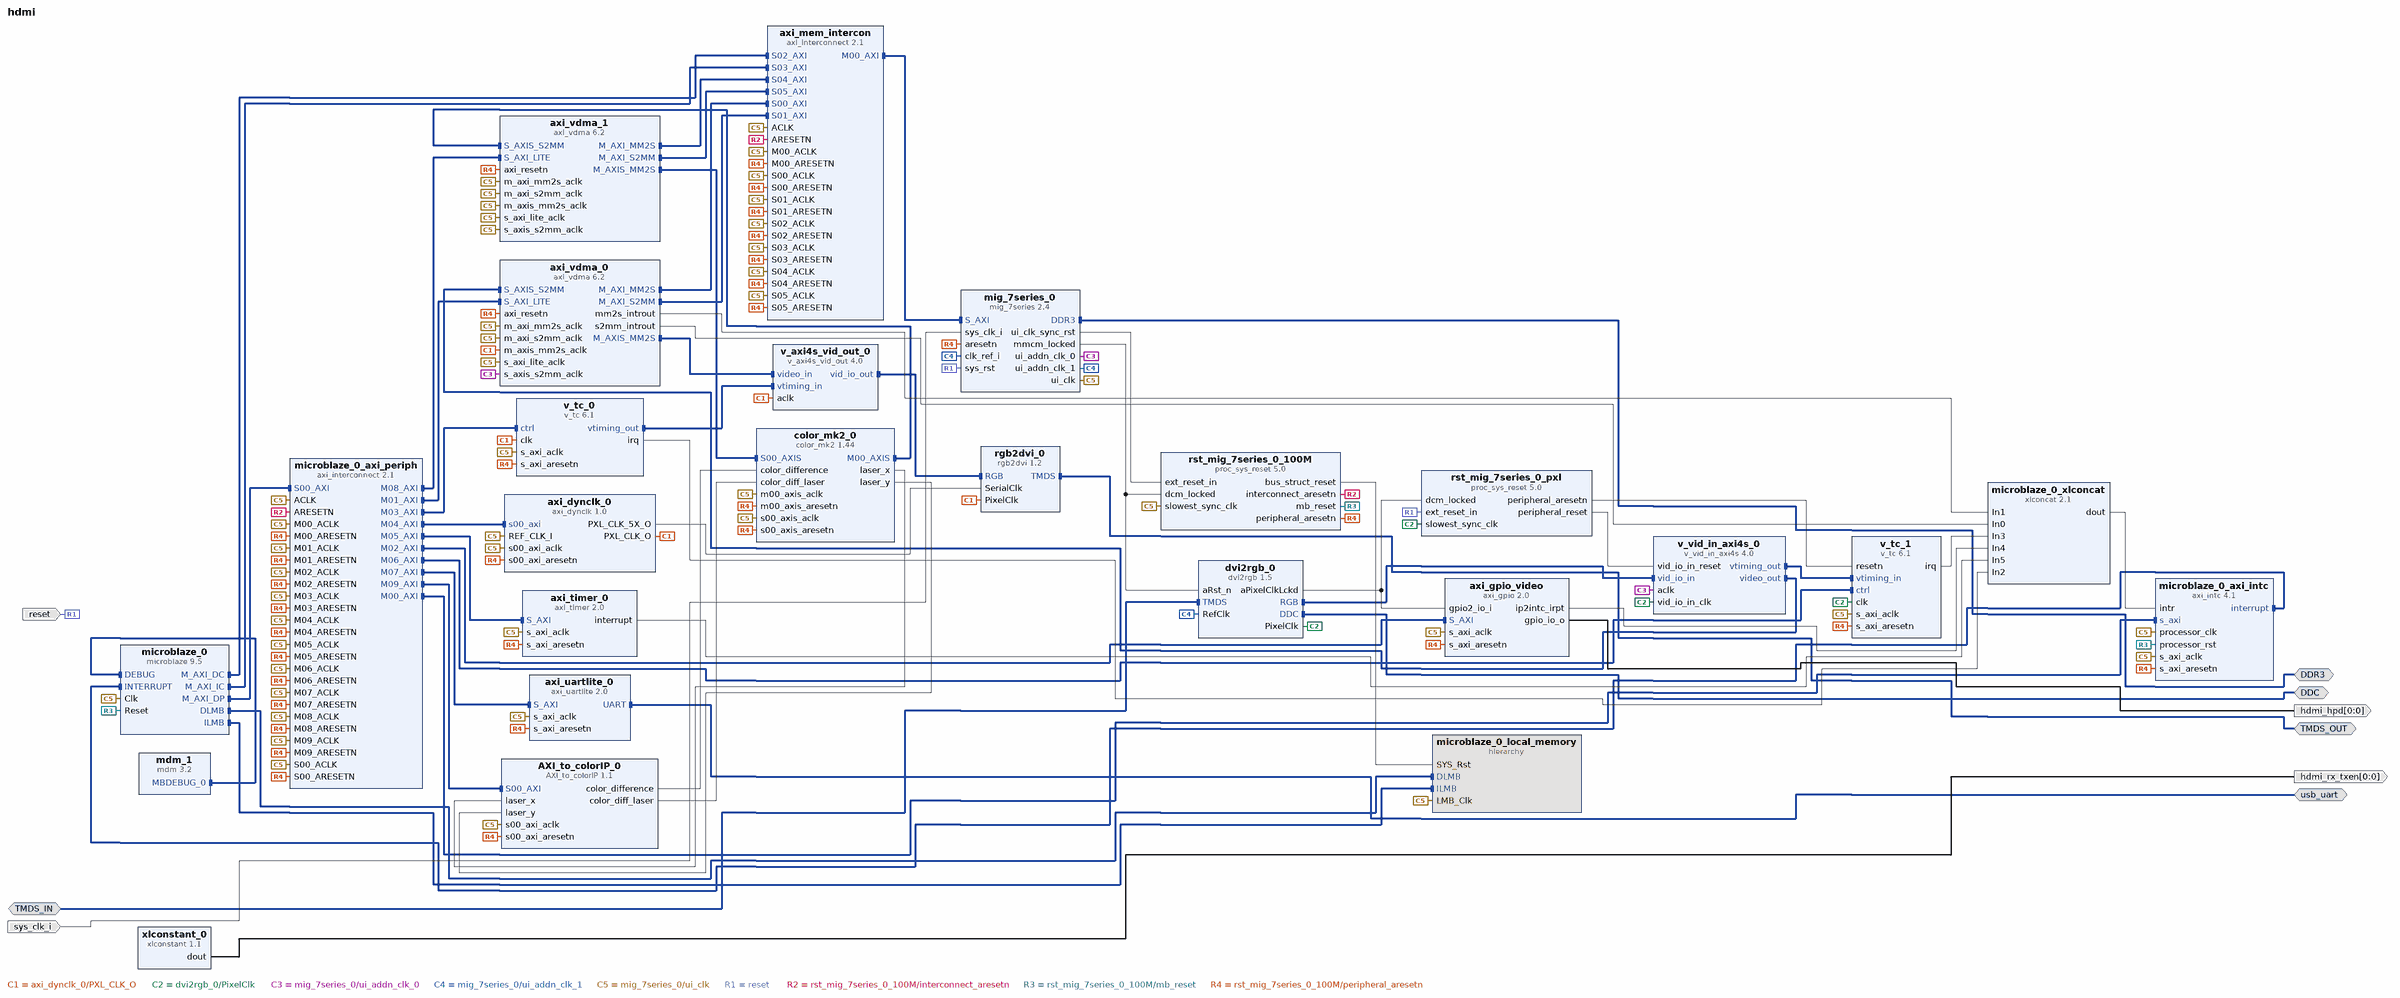
[diagram p0: block diagram of the top level]
# Vivado block design hdmi, Vivado 2015.3
create_bd_design hdmi

create_bd_intf_port -mode Master -vlnv xilinx.com:interface:iic_rtl:1.0 DDC
create_bd_intf_port -mode Master -vlnv xilinx.com:interface:ddrx_rtl:1.0 DDR3
create_bd_intf_port -mode Slave -vlnv digilentinc.com:interface:tmds_rtl:1.0 TMDS_IN
create_bd_intf_port -mode Master -vlnv digilentinc.com:interface:tmds_rtl:1.0 TMDS_OUT
create_bd_intf_port -mode Master -vlnv xilinx.com:interface:uart_rtl:1.0 usb_uart
create_bd_port -dir O -from 0 -to 0 hdmi_hpd
create_bd_port -dir I -type rst reset
set_property -dict {CONFIG.POLARITY ACTIVE_LOW} [get_bd_ports reset]
create_bd_port -dir I -type clk sys_clk_i
set_property -dict {CONFIG.FREQ_HZ 200000000 CONFIG.PHASE 0.0 CONFIG.CLK_DOMAIN /clk_wiz_0_clk_out1} [get_bd_ports sys_clk_i]
create_bd_port -dir O -from 0 -to 0 hdmi_rx_txen

create_bd_cell -type ip -vlnv digilentinc.com:ip:axi_dynclk:1.0 axi_dynclk_0
create_bd_cell -type ip -vlnv xilinx.com:ip:axi_gpio:2.0 axi_gpio_video
set_property -dict [list \
  CONFIG.C_GPIO_WIDTH 1 \
  CONFIG.C_GPIO2_WIDTH 1 \
  CONFIG.C_IS_DUAL 1 \
  CONFIG.C_ALL_INPUTS_2 1 \
  CONFIG.C_INTERRUPT_PRESENT 1 \
  CONFIG.USE_BOARD_FLOW true \
  CONFIG.GPIO_BOARD_INTERFACE Custom \
  CONFIG.C_ALL_OUTPUTS 1 \
] [get_bd_cells axi_gpio_video]
create_bd_cell -type ip -vlnv xilinx.com:ip:axi_interconnect:2.1 axi_mem_intercon
set_property -dict [list \
  CONFIG.NUM_SI 6 \
  CONFIG.NUM_MI 1 \
  CONFIG.STRATEGY 2 \
  CONFIG.M00_HAS_REGSLICE 4 \
  CONFIG.M00_HAS_DATA_FIFO 0 \
  CONFIG.S00_HAS_REGSLICE 4 \
  CONFIG.S01_HAS_REGSLICE 4 \
  CONFIG.S02_HAS_REGSLICE 4 \
  CONFIG.S03_HAS_REGSLICE 4 \
  CONFIG.S00_HAS_DATA_FIFO 2 \
  CONFIG.S01_HAS_DATA_FIFO 2 \
  CONFIG.S02_HAS_DATA_FIFO 2 \
  CONFIG.S03_HAS_DATA_FIFO 2 \
  CONFIG.S04_HAS_DATA_FIFO 2 \
  CONFIG.S05_HAS_DATA_FIFO 2 \
] [get_bd_cells axi_mem_intercon]
create_bd_cell -type ip -vlnv xilinx.com:ip:axi_timer:2.0 axi_timer_0
create_bd_cell -type ip -vlnv xilinx.com:ip:axi_uartlite:2.0 axi_uartlite_0
set_property -dict [list \
  CONFIG.C_BAUDRATE 115200 \
  CONFIG.USE_BOARD_FLOW true \
  CONFIG.UARTLITE_BOARD_INTERFACE usb_uart \
] [get_bd_cells axi_uartlite_0]
create_bd_cell -type ip -vlnv xilinx.com:ip:axi_vdma:6.2 axi_vdma_0
set_property -dict [list \
  CONFIG.c_m_axi_mm2s_data_width 128 \
  CONFIG.c_m_axis_mm2s_tdata_width 24 \
  CONFIG.c_m_axi_s2mm_data_width 128 \
  CONFIG.c_include_s2mm_dre 0 \
  CONFIG.c_mm2s_genlock_mode 0 \
  CONFIG.c_s2mm_genlock_mode 0 \
  CONFIG.c_mm2s_linebuffer_depth 4096 \
  CONFIG.c_s2mm_linebuffer_depth 4096 \
  CONFIG.c_mm2s_max_burst_length 32 \
  CONFIG.c_s2mm_max_burst_length 32 \
  CONFIG.c_include_s2mm 1 \
  CONFIG.c_addr_width 32 \
] [get_bd_cells axi_vdma_0]
create_bd_cell -type ip -vlnv digilentinc.com:ip:dvi2rgb:1.5 dvi2rgb_0
set_property -dict {CONFIG.kRstActiveHigh false CONFIG.kClkRange 2 CONFIG.kAddBUFG false} [get_bd_cells dvi2rgb_0]
create_bd_cell -type ip -vlnv xilinx.com:ip:mdm:3.2 mdm_1
create_bd_cell -type ip -vlnv xilinx.com:ip:microblaze:9.5 microblaze_0
set_property -dict [list \
  CONFIG.C_D_AXI 1 \
  CONFIG.C_D_LMB 1 \
  CONFIG.C_I_LMB 1 \
  CONFIG.C_ENABLE_DISCRETE_PORTS 0 \
  CONFIG.G_TEMPLATE_LIST 2 \
  CONFIG.G_USE_EXCEPTIONS 1 \
  CONFIG.C_USE_MSR_INSTR 1 \
  CONFIG.C_USE_PCMP_INSTR 1 \
  CONFIG.C_USE_REORDER_INSTR 1 \
  CONFIG.C_USE_BARREL 1 \
  CONFIG.C_USE_DIV 1 \
  CONFIG.C_USE_HW_MUL 2 \
  CONFIG.C_USE_FPU 2 \
  CONFIG.C_DEBUG_ENABLED 2 \
  CONFIG.C_DEBUG_COUNTER_WIDTH 32 \
  CONFIG.C_USE_ICACHE 1 \
  CONFIG.C_CACHE_BYTE_SIZE 32768 \
  CONFIG.C_ICACHE_LINE_LEN 8 \
  CONFIG.C_ICACHE_VICTIMS 8 \
  CONFIG.C_ICACHE_STREAMS 1 \
  CONFIG.C_ICACHE_DATA_WIDTH 1 \
  CONFIG.C_USE_DCACHE 1 \
  CONFIG.C_DCACHE_BYTE_SIZE 32768 \
  CONFIG.C_DCACHE_LINE_LEN 8 \
  CONFIG.C_DCACHE_USE_WRITEBACK 1 \
  CONFIG.C_DCACHE_VICTIMS 8 \
  CONFIG.C_DCACHE_DATA_WIDTH 1 \
  CONFIG.C_USE_BRANCH_TARGET_CACHE 0 \
] [get_bd_cells microblaze_0]
create_bd_cell -type ip -vlnv xilinx.com:ip:axi_intc:4.1 microblaze_0_axi_intc
set_property -dict {CONFIG.C_HAS_FAST 1} [get_bd_cells microblaze_0_axi_intc]
create_bd_cell -type ip -vlnv xilinx.com:ip:axi_interconnect:2.1 microblaze_0_axi_periph
set_property -dict {CONFIG.NUM_MI 10} [get_bd_cells microblaze_0_axi_periph]
create_bd_cell -type hier microblaze_0_local_memory
create_bd_cell -type ip -vlnv xilinx.com:ip:xlconcat:2.1 microblaze_0_xlconcat
set_property -dict {CONFIG.NUM_PORTS 6} [get_bd_cells microblaze_0_xlconcat]
create_bd_cell -type ip -vlnv xilinx.com:ip:mig_7series:2.4 mig_7series_0
set_property -dict [list \
  CONFIG.XML_INPUT_FILE mig_b.prj \
  CONFIG.RESET_BOARD_INTERFACE reset \
  CONFIG.BOARD_MIG_PARAM Custom \
] [get_bd_cells mig_7series_0]
create_bd_cell -type ip -vlnv digilentinc.com:ip:rgb2dvi:1.2 rgb2dvi_0
set_property -dict {CONFIG.kRstActiveHigh false CONFIG.kGenerateSerialClk false CONFIG.kClkRange 2} [get_bd_cells rgb2dvi_0]
create_bd_cell -type ip -vlnv xilinx.com:ip:proc_sys_reset:5.0 rst_mig_7series_0_100M
create_bd_cell -type ip -vlnv xilinx.com:ip:proc_sys_reset:5.0 rst_mig_7series_0_pxl
set_property -dict {CONFIG.USE_BOARD_FLOW true CONFIG.RESET_BOARD_INTERFACE Custom} [get_bd_cells rst_mig_7series_0_pxl]
create_bd_cell -type ip -vlnv xilinx.com:ip:v_axi4s_vid_out:4.0 v_axi4s_vid_out_0
set_property -dict [list \
  CONFIG.C_S_AXIS_VIDEO_FORMAT 2 \
  CONFIG.C_S_AXIS_VIDEO_DATA_WIDTH 8 \
  CONFIG.C_ADDR_WIDTH 5 \
  CONFIG.C_VTG_MASTER_SLAVE 1 \
] [get_bd_cells v_axi4s_vid_out_0]
create_bd_cell -type ip -vlnv xilinx.com:ip:v_tc:6.1 v_tc_0
set_property -dict {CONFIG.enable_detection false} [get_bd_cells v_tc_0]
create_bd_cell -type ip -vlnv xilinx.com:ip:v_tc:6.1 v_tc_1
set_property -dict [list \
  CONFIG.HAS_INTC_IF true \
  CONFIG.max_lines_per_frame 2048 \
  CONFIG.horizontal_blank_detection false \
  CONFIG.enable_generation false \
  CONFIG.vertical_blank_detection false \
] [get_bd_cells v_tc_1]
create_bd_cell -type ip -vlnv xilinx.com:ip:v_vid_in_axi4s:4.0 v_vid_in_axi4s_0
set_property -dict {CONFIG.C_HAS_ASYNC_CLK 1 CONFIG.C_ADDR_WIDTH 5} [get_bd_cells v_vid_in_axi4s_0]
create_bd_cell -type ip -vlnv xilinx.com:ip:xlconstant:1.1 xlconstant_0
create_bd_cell -type ip -vlnv xilinx.com:ip:axi_vdma:6.2 axi_vdma_1
set_property -dict [list \
  CONFIG.c_m_axi_mm2s_data_width 128 \
  CONFIG.c_m_axis_mm2s_tdata_width 24 \
  CONFIG.c_m_axi_s2mm_data_width 128 \
  CONFIG.c_include_s2mm_dre 0 \
  CONFIG.c_num_fstores 32 \
  CONFIG.c_use_s2mm_fsync 0 \
  CONFIG.c_mm2s_genlock_mode 0 \
  CONFIG.c_s2mm_genlock_mode 0 \
  CONFIG.c_mm2s_linebuffer_depth 16384 \
  CONFIG.c_s2mm_linebuffer_depth 16384 \
  CONFIG.c_mm2s_max_burst_length 32 \
  CONFIG.c_s2mm_max_burst_length 32 \
  CONFIG.c_include_s2mm 1 \
  CONFIG.c_addr_width 32 \
] [get_bd_cells axi_vdma_1]
create_bd_cell -type ip -vlnv xilinx.com:user:AXI_to_colorIP:1.1 AXI_to_colorIP_0
create_bd_cell -type ip -vlnv xilinx.com:user:color_mk2:1.44 color_mk2_0
set_property -dict {CONFIG.V_RESOLUTION 720 CONFIG.H_RESOLUTION 1920 CONFIG.NUM_LINES 4} [get_bd_cells color_mk2_0]

# ---- hierarchy /microblaze_0_local_memory ----
current_bd_instance /microblaze_0_local_memory
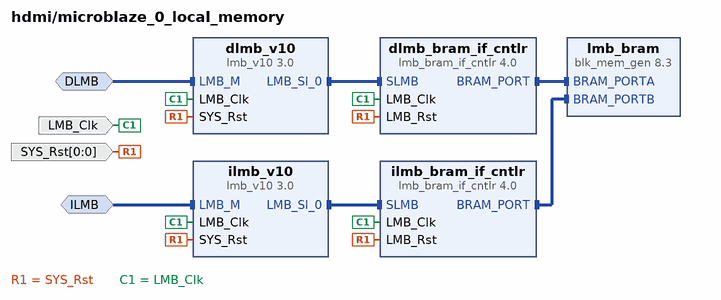
[diagram p1: block diagram inside /microblaze_0_local_memory]
create_bd_intf_pin -mode MirroredMaster -vlnv xilinx.com:interface:lmb_rtl:1.0 DLMB
create_bd_intf_pin -mode MirroredMaster -vlnv xilinx.com:interface:lmb_rtl:1.0 ILMB
create_bd_pin -dir I -type clk LMB_Clk
create_bd_pin -dir I -from 0 -to 0 -type rst SYS_Rst

create_bd_cell -type ip -vlnv xilinx.com:ip:lmb_bram_if_cntlr:4.0 dlmb_bram_if_cntlr
set_property -dict {CONFIG.C_ECC 0} [get_bd_cells dlmb_bram_if_cntlr]
create_bd_cell -type ip -vlnv xilinx.com:ip:lmb_v10:3.0 dlmb_v10
create_bd_cell -type ip -vlnv xilinx.com:ip:lmb_bram_if_cntlr:4.0 ilmb_bram_if_cntlr
set_property -dict {CONFIG.C_ECC 0} [get_bd_cells ilmb_bram_if_cntlr]
create_bd_cell -type ip -vlnv xilinx.com:ip:lmb_v10:3.0 ilmb_v10
create_bd_cell -type ip -vlnv xilinx.com:ip:blk_mem_gen:8.3 lmb_bram
set_property -dict {CONFIG.Memory_Type True_Dual_Port_RAM CONFIG.use_bram_block BRAM_Controller} [get_bd_cells lmb_bram]

# ---- connections ----

current_bd_instance /microblaze_0_local_memory
connect_bd_intf_net -intf_net microblaze_0_dlmb_bus [get_bd_intf_pins dlmb_bram_if_cntlr/SLMB] [get_bd_intf_pins dlmb_v10/LMB_Sl_0]
connect_bd_intf_net -intf_net microblaze_0_dlmb_cntlr [get_bd_intf_pins dlmb_bram_if_cntlr/BRAM_PORT] [get_bd_intf_pins lmb_bram/BRAM_PORTA]
connect_bd_intf_net -intf_net microblaze_0_ilmb_bus [get_bd_intf_pins ilmb_bram_if_cntlr/SLMB] [get_bd_intf_pins ilmb_v10/LMB_Sl_0]
connect_bd_intf_net -intf_net microblaze_0_ilmb_cntlr [get_bd_intf_pins ilmb_bram_if_cntlr/BRAM_PORT] [get_bd_intf_pins lmb_bram/BRAM_PORTB]
connect_bd_intf_net -intf_net microblaze_0_dlmb [get_bd_intf_pins DLMB] [get_bd_intf_pins dlmb_v10/LMB_M]
connect_bd_intf_net -intf_net microblaze_0_ilmb [get_bd_intf_pins ILMB] [get_bd_intf_pins ilmb_v10/LMB_M]
connect_bd_net [get_bd_pins SYS_Rst] \
  [get_bd_pins dlmb_bram_if_cntlr/LMB_Rst] [get_bd_pins dlmb_v10/SYS_Rst] [get_bd_pins ilmb_bram_if_cntlr/LMB_Rst] \
  [get_bd_pins ilmb_v10/SYS_Rst]
connect_bd_net -net microblaze_0_Clk [get_bd_pins LMB_Clk] \
  [get_bd_pins dlmb_bram_if_cntlr/LMB_Clk] [get_bd_pins dlmb_v10/LMB_Clk] [get_bd_pins ilmb_bram_if_cntlr/LMB_Clk] \
  [get_bd_pins ilmb_v10/LMB_Clk]

current_bd_instance /
connect_bd_intf_net [get_bd_intf_pins axi_mem_intercon/M00_AXI] [get_bd_intf_pins mig_7series_0/S_AXI]
connect_bd_intf_net [get_bd_intf_pins axi_vdma_0/M_AXIS_MM2S] [get_bd_intf_pins v_axi4s_vid_out_0/video_in]
connect_bd_intf_net [get_bd_intf_pins axi_mem_intercon/S00_AXI] [get_bd_intf_pins axi_vdma_0/M_AXI_MM2S]
connect_bd_intf_net [get_bd_intf_pins axi_mem_intercon/S01_AXI] [get_bd_intf_pins axi_vdma_0/M_AXI_S2MM]
connect_bd_intf_net [get_bd_intf_pins dvi2rgb_0/RGB] [get_bd_intf_pins v_vid_in_axi4s_0/vid_io_in]
connect_bd_intf_net [get_bd_intf_pins axi_mem_intercon/S02_AXI] [get_bd_intf_pins microblaze_0/M_AXI_DC]
connect_bd_intf_net [get_bd_intf_pins axi_mem_intercon/S03_AXI] [get_bd_intf_pins microblaze_0/M_AXI_IC]
connect_bd_intf_net -intf_net microblaze_0_axi_dp [get_bd_intf_pins microblaze_0/M_AXI_DP] [get_bd_intf_pins microblaze_0_axi_periph/S00_AXI]
connect_bd_intf_net [get_bd_intf_pins axi_vdma_0/S_AXI_LITE] [get_bd_intf_pins microblaze_0_axi_periph/M01_AXI]
connect_bd_intf_net [get_bd_intf_pins axi_gpio_video/S_AXI] [get_bd_intf_pins microblaze_0_axi_periph/M02_AXI]
connect_bd_intf_net [get_bd_intf_pins microblaze_0_axi_periph/M03_AXI] [get_bd_intf_pins v_tc_0/ctrl]
connect_bd_intf_net [get_bd_intf_pins axi_dynclk_0/s00_axi] [get_bd_intf_pins microblaze_0_axi_periph/M04_AXI]
connect_bd_intf_net [get_bd_intf_pins axi_timer_0/S_AXI] [get_bd_intf_pins microblaze_0_axi_periph/M05_AXI]
connect_bd_intf_net [get_bd_intf_pins microblaze_0_axi_periph/M06_AXI] [get_bd_intf_pins v_tc_1/ctrl]
connect_bd_intf_net [get_bd_intf_pins axi_uartlite_0/S_AXI] [get_bd_intf_pins microblaze_0_axi_periph/M07_AXI]
connect_bd_intf_net [get_bd_intf_pins mdm_1/MBDEBUG_0] [get_bd_intf_pins microblaze_0/DEBUG]
connect_bd_intf_net [get_bd_intf_pins microblaze_0/DLMB] [get_bd_intf_pins microblaze_0_local_memory/DLMB]
connect_bd_intf_net [get_bd_intf_pins microblaze_0/ILMB] [get_bd_intf_pins microblaze_0_local_memory/ILMB]
connect_bd_intf_net -intf_net microblaze_0_intc_axi [get_bd_intf_pins microblaze_0_axi_intc/s_axi] [get_bd_intf_pins microblaze_0_axi_periph/M00_AXI]
connect_bd_intf_net [get_bd_intf_pins microblaze_0/INTERRUPT] [get_bd_intf_pins microblaze_0_axi_intc/interrupt]
connect_bd_intf_net [get_bd_intf_pins rgb2dvi_0/RGB] [get_bd_intf_pins v_axi4s_vid_out_0/vid_io_out]
connect_bd_intf_net [get_bd_intf_pins v_axi4s_vid_out_0/vtiming_in] [get_bd_intf_pins v_tc_0/vtiming_out]
connect_bd_intf_net [get_bd_intf_pins axi_vdma_0/S_AXIS_S2MM] [get_bd_intf_pins v_vid_in_axi4s_0/video_out]
connect_bd_intf_net [get_bd_intf_pins v_tc_1/vtiming_in] [get_bd_intf_pins v_vid_in_axi4s_0/vtiming_out]
connect_bd_intf_net [get_bd_intf_pins microblaze_0_axi_periph/M08_AXI] [get_bd_intf_pins axi_vdma_1/S_AXI_LITE]
connect_bd_intf_net [get_bd_intf_pins axi_vdma_1/M_AXI_MM2S] [get_bd_intf_pins axi_mem_intercon/S04_AXI]
connect_bd_intf_net [get_bd_intf_pins axi_vdma_1/M_AXI_S2MM] [get_bd_intf_pins axi_mem_intercon/S05_AXI]
connect_bd_intf_net [get_bd_intf_pins microblaze_0_axi_periph/M09_AXI] [get_bd_intf_pins AXI_to_colorIP_0/S00_AXI]
connect_bd_intf_net [get_bd_intf_pins color_mk2_0/S00_AXIS] [get_bd_intf_pins axi_vdma_1/M_AXIS_MM2S]
connect_bd_intf_net [get_bd_intf_pins color_mk2_0/M00_AXIS] [get_bd_intf_pins axi_vdma_1/S_AXIS_S2MM]
connect_bd_intf_net [get_bd_intf_ports DDC] [get_bd_intf_pins dvi2rgb_0/DDC]
connect_bd_intf_net [get_bd_intf_ports DDR3] [get_bd_intf_pins mig_7series_0/DDR3]
connect_bd_intf_net [get_bd_intf_ports TMDS_IN] [get_bd_intf_pins dvi2rgb_0/TMDS]
connect_bd_intf_net [get_bd_intf_ports TMDS_OUT] [get_bd_intf_pins rgb2dvi_0/TMDS]
connect_bd_intf_net [get_bd_intf_ports usb_uart] [get_bd_intf_pins axi_uartlite_0/UART]
connect_bd_net -net SYS_Rst_1 [get_bd_pins rst_mig_7series_0_100M/bus_struct_reset] [get_bd_pins microblaze_0_local_memory/SYS_Rst]
connect_bd_net [get_bd_pins axi_dynclk_0/PXL_CLK_5X_O] [get_bd_pins rgb2dvi_0/SerialClk]
connect_bd_net [get_bd_pins axi_dynclk_0/PXL_CLK_O] \
  [get_bd_pins axi_vdma_0/m_axis_mm2s_aclk] [get_bd_pins rgb2dvi_0/PixelClk] [get_bd_pins v_axi4s_vid_out_0/aclk] \
  [get_bd_pins v_tc_0/clk]
connect_bd_net [get_bd_pins axi_gpio_video/gpio_io_o] [get_bd_ports hdmi_hpd]
connect_bd_net [get_bd_pins axi_gpio_video/ip2intc_irpt] [get_bd_pins microblaze_0_xlconcat/In4]
connect_bd_net [get_bd_pins axi_timer_0/interrupt] [get_bd_pins microblaze_0_xlconcat/In5]
connect_bd_net [get_bd_pins axi_vdma_0/mm2s_introut] [get_bd_pins microblaze_0_xlconcat/In1]
connect_bd_net [get_bd_pins axi_vdma_0/s2mm_introut] [get_bd_pins microblaze_0_xlconcat/In0]
connect_bd_net [get_bd_pins dvi2rgb_0/PixelClk] \
  [get_bd_pins rst_mig_7series_0_pxl/slowest_sync_clk] [get_bd_pins v_tc_1/clk] [get_bd_pins v_vid_in_axi4s_0/vid_io_in_clk]
connect_bd_net [get_bd_pins dvi2rgb_0/aPixelClkLckd] [get_bd_pins axi_gpio_video/gpio2_io_i] [get_bd_pins rst_mig_7series_0_pxl/dcm_locked]
connect_bd_net -net microblaze_0_intr [get_bd_pins microblaze_0_xlconcat/dout] [get_bd_pins microblaze_0_axi_intc/intr]
connect_bd_net [get_bd_pins mig_7series_0/mmcm_locked] [get_bd_pins dvi2rgb_0/aRst_n] [get_bd_pins rst_mig_7series_0_100M/dcm_locked]
connect_bd_net [get_bd_pins mig_7series_0/ui_addn_clk_0] [get_bd_pins axi_vdma_0/s_axis_s2mm_aclk] [get_bd_pins v_vid_in_axi4s_0/aclk]
connect_bd_net [get_bd_pins mig_7series_0/ui_addn_clk_1] [get_bd_pins dvi2rgb_0/RefClk] [get_bd_pins mig_7series_0/clk_ref_i]
connect_bd_net [get_bd_pins mig_7series_0/ui_clk] \
  [get_bd_pins axi_dynclk_0/REF_CLK_I] [get_bd_pins axi_dynclk_0/s00_axi_aclk] [get_bd_pins axi_gpio_video/s_axi_aclk] \
  [get_bd_pins axi_timer_0/s_axi_aclk] [get_bd_pins axi_uartlite_0/s_axi_aclk] [get_bd_pins axi_vdma_0/m_axi_mm2s_aclk] \
  [get_bd_pins axi_vdma_0/m_axi_s2mm_aclk] [get_bd_pins axi_vdma_0/s_axi_lite_aclk] [get_bd_pins microblaze_0/Clk] \
  [get_bd_pins microblaze_0_axi_intc/processor_clk] [get_bd_pins microblaze_0_axi_intc/s_axi_aclk] \
  [get_bd_pins rst_mig_7series_0_100M/slowest_sync_clk] [get_bd_pins v_tc_0/s_axi_aclk] [get_bd_pins v_tc_1/s_axi_aclk] \
  [get_bd_pins axi_vdma_1/s_axi_lite_aclk] [get_bd_pins axi_vdma_1/m_axi_mm2s_aclk] [get_bd_pins axi_vdma_1/m_axi_s2mm_aclk] \
  [get_bd_pins axi_vdma_1/m_axis_mm2s_aclk] [get_bd_pins axi_vdma_1/s_axis_s2mm_aclk] \
  [get_bd_pins AXI_to_colorIP_0/s00_axi_aclk] [get_bd_pins color_mk2_0/s00_axis_aclk] [get_bd_pins color_mk2_0/m00_axis_aclk] \
  [get_bd_pins axi_mem_intercon/ACLK] [get_bd_pins axi_mem_intercon/M00_ACLK] [get_bd_pins axi_mem_intercon/S00_ACLK] \
  [get_bd_pins axi_mem_intercon/S01_ACLK] [get_bd_pins axi_mem_intercon/S02_ACLK] [get_bd_pins axi_mem_intercon/S03_ACLK] \
  [get_bd_pins microblaze_0_axi_periph/ACLK] [get_bd_pins microblaze_0_axi_periph/M00_ACLK] \
  [get_bd_pins microblaze_0_axi_periph/M01_ACLK] [get_bd_pins microblaze_0_axi_periph/M02_ACLK] \
  [get_bd_pins microblaze_0_axi_periph/M03_ACLK] [get_bd_pins microblaze_0_axi_periph/M04_ACLK] \
  [get_bd_pins microblaze_0_axi_periph/M05_ACLK] [get_bd_pins microblaze_0_axi_periph/M06_ACLK] \
  [get_bd_pins microblaze_0_axi_periph/M07_ACLK] [get_bd_pins microblaze_0_axi_periph/S00_ACLK] \
  [get_bd_pins microblaze_0_local_memory/LMB_Clk] [get_bd_pins microblaze_0_axi_periph/M08_ACLK] \
  [get_bd_pins axi_mem_intercon/S04_ACLK] [get_bd_pins axi_mem_intercon/S05_ACLK] \
  [get_bd_pins microblaze_0_axi_periph/M09_ACLK]
connect_bd_net [get_bd_pins mig_7series_0/ui_clk_sync_rst] [get_bd_pins rst_mig_7series_0_100M/ext_reset_in]
connect_bd_net [get_bd_ports reset] [get_bd_pins mig_7series_0/sys_rst] [get_bd_pins rst_mig_7series_0_pxl/ext_reset_in]
connect_bd_net [get_bd_pins rst_mig_7series_0_100M/interconnect_aresetn] \
  [get_bd_pins axi_mem_intercon/ARESETN] [get_bd_pins microblaze_0_axi_periph/ARESETN]
connect_bd_net [get_bd_pins rst_mig_7series_0_100M/mb_reset] [get_bd_pins microblaze_0/Reset] [get_bd_pins microblaze_0_axi_intc/processor_rst]
connect_bd_net [get_bd_pins rst_mig_7series_0_100M/peripheral_aresetn] \
  [get_bd_pins axi_dynclk_0/s00_axi_aresetn] [get_bd_pins axi_gpio_video/s_axi_aresetn] \
  [get_bd_pins axi_timer_0/s_axi_aresetn] [get_bd_pins axi_uartlite_0/s_axi_aresetn] [get_bd_pins axi_vdma_0/axi_resetn] \
  [get_bd_pins microblaze_0_axi_intc/s_axi_aresetn] [get_bd_pins mig_7series_0/aresetn] [get_bd_pins v_tc_0/s_axi_aresetn] \
  [get_bd_pins v_tc_1/s_axi_aresetn] [get_bd_pins axi_vdma_1/axi_resetn] [get_bd_pins AXI_to_colorIP_0/s00_axi_aresetn] \
  [get_bd_pins color_mk2_0/s00_axis_aresetn] [get_bd_pins color_mk2_0/m00_axis_aresetn] \
  [get_bd_pins axi_mem_intercon/M00_ARESETN] [get_bd_pins axi_mem_intercon/S00_ARESETN] \
  [get_bd_pins axi_mem_intercon/S01_ARESETN] [get_bd_pins axi_mem_intercon/S02_ARESETN] \
  [get_bd_pins axi_mem_intercon/S03_ARESETN] [get_bd_pins microblaze_0_axi_periph/M00_ARESETN] \
  [get_bd_pins microblaze_0_axi_periph/M01_ARESETN] [get_bd_pins microblaze_0_axi_periph/M02_ARESETN] \
  [get_bd_pins microblaze_0_axi_periph/M03_ARESETN] [get_bd_pins microblaze_0_axi_periph/M04_ARESETN] \
  [get_bd_pins microblaze_0_axi_periph/M05_ARESETN] [get_bd_pins microblaze_0_axi_periph/M06_ARESETN] \
  [get_bd_pins microblaze_0_axi_periph/M07_ARESETN] [get_bd_pins microblaze_0_axi_periph/S00_ARESETN] \
  [get_bd_pins microblaze_0_axi_periph/M08_ARESETN] [get_bd_pins axi_mem_intercon/S04_ARESETN] \
  [get_bd_pins axi_mem_intercon/S05_ARESETN] [get_bd_pins microblaze_0_axi_periph/M09_ARESETN]
connect_bd_net [get_bd_pins rst_mig_7series_0_pxl/peripheral_aresetn] [get_bd_pins v_tc_1/resetn]
connect_bd_net [get_bd_pins rst_mig_7series_0_pxl/peripheral_reset] [get_bd_pins v_vid_in_axi4s_0/vid_io_in_reset]
connect_bd_net [get_bd_ports sys_clk_i] [get_bd_pins mig_7series_0/sys_clk_i]
connect_bd_net [get_bd_pins v_tc_0/irq] [get_bd_pins microblaze_0_xlconcat/In2]
connect_bd_net [get_bd_pins v_tc_1/irq] [get_bd_pins microblaze_0_xlconcat/In3]
connect_bd_net [get_bd_pins xlconstant_0/dout] [get_bd_ports hdmi_rx_txen]
connect_bd_net [get_bd_pins color_mk2_0/laser_x] [get_bd_pins AXI_to_colorIP_0/laser_x]
connect_bd_net [get_bd_pins color_mk2_0/laser_y] [get_bd_pins AXI_to_colorIP_0/laser_y]
connect_bd_net [get_bd_pins AXI_to_colorIP_0/color_difference] [get_bd_pins color_mk2_0/color_difference]
connect_bd_net [get_bd_pins AXI_to_colorIP_0/color_diff_laser] [get_bd_pins color_mk2_0/color_diff_laser]

# ---- address map ----
assign_bd_address -offset 0x80000000 -range 512M -target_address_space [get_bd_addr_spaces axi_vdma_0/Data_MM2S] [get_bd_addr_segs mig_7series_0/memmap/memaddr]
assign_bd_address -offset 0x80000000 -range 512M -target_address_space [get_bd_addr_spaces axi_vdma_0/Data_S2MM] [get_bd_addr_segs mig_7series_0/memmap/memaddr]
assign_bd_address -offset 0x80000000 -range 512M -target_address_space [get_bd_addr_spaces axi_vdma_1/Data_MM2S] [get_bd_addr_segs mig_7series_0/memmap/memaddr]
assign_bd_address -offset 0x80000000 -range 512M -target_address_space [get_bd_addr_spaces axi_vdma_1/Data_S2MM] [get_bd_addr_segs mig_7series_0/memmap/memaddr]
assign_bd_address -offset 0x00000000 -range 1M -target_address_space [get_bd_addr_spaces microblaze_0/Data] [get_bd_addr_segs microblaze_0_local_memory/dlmb_bram_if_cntlr/SLMB/Mem]
assign_bd_address -offset 0x40000000 -range 64K -target_address_space [get_bd_addr_spaces microblaze_0/Data] [get_bd_addr_segs axi_gpio_video/S_AXI/Reg]
assign_bd_address -offset 0x40600000 -range 64K -target_address_space [get_bd_addr_spaces microblaze_0/Data] [get_bd_addr_segs axi_uartlite_0/S_AXI/Reg]
assign_bd_address -offset 0x41200000 -range 64K -target_address_space [get_bd_addr_spaces microblaze_0/Data] [get_bd_addr_segs microblaze_0_axi_intc/s_axi/Reg]
assign_bd_address -offset 0x41C00000 -range 64K -target_address_space [get_bd_addr_spaces microblaze_0/Data] [get_bd_addr_segs axi_timer_0/S_AXI/Reg]
assign_bd_address -offset 0x44A00000 -range 64K -target_address_space [get_bd_addr_spaces microblaze_0/Data] [get_bd_addr_segs axi_vdma_0/S_AXI_LITE/Reg]
assign_bd_address -offset 0x44A10000 -range 64K -target_address_space [get_bd_addr_spaces microblaze_0/Data] [get_bd_addr_segs v_tc_0/ctrl/Reg]
assign_bd_address -offset 0x44A20000 -range 64K -target_address_space [get_bd_addr_spaces microblaze_0/Data] [get_bd_addr_segs axi_dynclk_0/s00_axi/reg0]
assign_bd_address -offset 0x44A30000 -range 64K -target_address_space [get_bd_addr_spaces microblaze_0/Data] [get_bd_addr_segs v_tc_1/ctrl/Reg]
assign_bd_address -offset 0x44A40000 -range 64K -target_address_space [get_bd_addr_spaces microblaze_0/Data] [get_bd_addr_segs axi_vdma_1/S_AXI_LITE/Reg]
assign_bd_address -offset 0x44A50000 -range 64K -target_address_space [get_bd_addr_spaces microblaze_0/Data] [get_bd_addr_segs AXI_to_colorIP_0/S00_AXI/S00_AXI_reg]
assign_bd_address -offset 0x80000000 -range 512M -target_address_space [get_bd_addr_spaces microblaze_0/Data] [get_bd_addr_segs mig_7series_0/memmap/memaddr]
assign_bd_address -offset 0x00000000 -range 1M -target_address_space [get_bd_addr_spaces microblaze_0/Instruction] [get_bd_addr_segs microblaze_0_local_memory/ilmb_bram_if_cntlr/SLMB/Mem]
assign_bd_address -offset 0x80000000 -range 512M -target_address_space [get_bd_addr_spaces microblaze_0/Instruction] [get_bd_addr_segs mig_7series_0/memmap/memaddr]

validate_bd_design
save_bd_design
